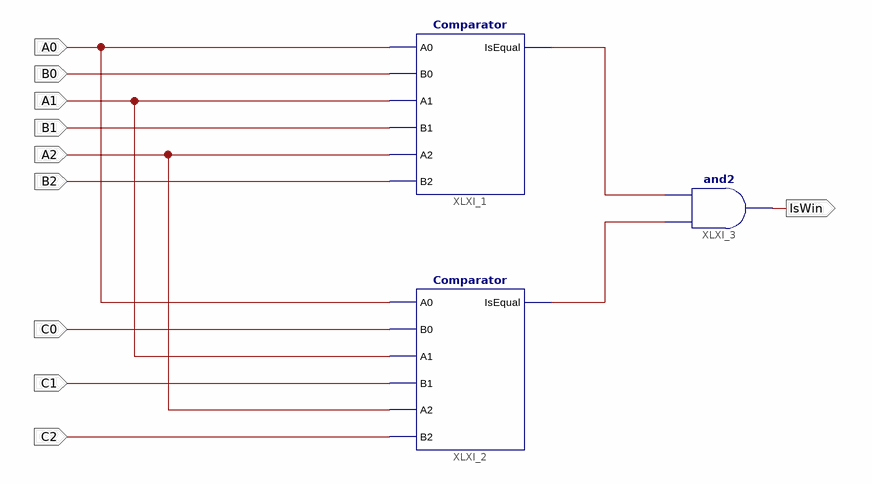
[diagram p0: schematic sheet 1]
// Xilinx ISE schematic SlotComparator.sch (spartan6) as structural Verilog: 3 symbols, 10 ports
module SlotComparator (
  input  A1,
  input  A2,
  input  B0,
  input  B2,
  input  C0,
  input  C1,
  input  C2,
  input  A0,
  input  B1,
  output IsWin
);

  wire XLXN_1, XLXN_2;

  Comparator XLXI_1 (.A0(A0), .B0(B0), .A1(A1), .B1(B1), .A2(A2), .B2(B2), .IsEqual(XLXN_1));
  Comparator XLXI_2 (.A0(A0), .B0(C0), .A1(A1), .B1(C1), .A2(A2), .B2(C2), .IsEqual(XLXN_2));
  and XLXI_3 (IsWin, XLXN_2, XLXN_1);
endmodule
